# Altium schematic sheet Power.SchDoc
size A
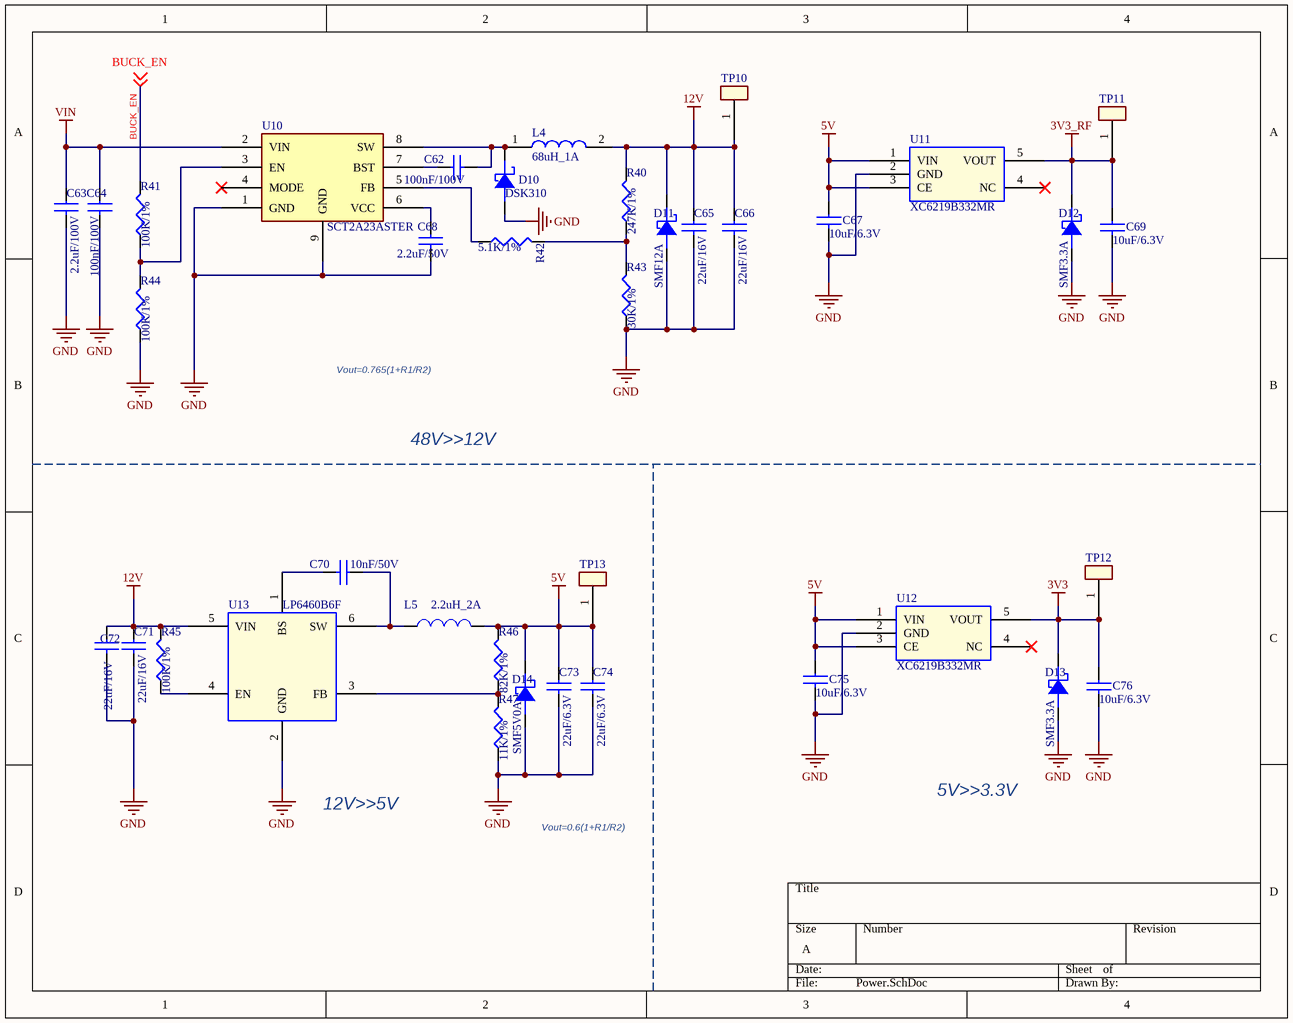
[diagram p0: Power.SchDoc]

## Parts
C62  100nF/100V  [C0603]
C63  2.2uF/100V  [C1206]
C64  100nF/100V  [C0603]
C65  22uF/16V  [C0805]
C66  22uF/16V  [C0805]
C67  10uF/6.3V  [C0402]
C68  2.2uF/50V  [C0603]
C69  10uF/6.3V  [C0402]
C70  10nF/50V  [C0402]
C71  22uF/16V  [C0805]
C72  22uF/16V  [C0805]
C73  22uF/6.3V  [C0805]
C74  22uF/6.3V  [C0805]
C75  10uF/6.3V  [C0402]
C76  10uF/6.3V  [C0402]
D10  DSK310  [SOD-123F]
D11  SMF12A  [SOD-123F]
D12  SMF3.3A  [SOD-123F]
D13  SMF3.3A  [SOD-123F]
D14  SMF5V0A  [SOD-123F]
L4  68uH_1A  [L5040]
L5  2.2uH_2A  [L4020]
R40  247K/1%  [R0402]
R41  100K/1%  [R0402]
R42  5.1K/1%  [R0402]
R43  30K/1%  [R0402]
R44  100K/1%  [R0402]
R45  100K/1%  [R0402]
R46  82K/1%  [R0402]
R47  11K/1%  [R0402]
TP10  TEST POINT  [test_point_100_smd]  (value not drawn)
TP11  TEST POINT  [test_point_100_smd]  (value not drawn)
TP12  TEST POINT  [test_point_100_smd]  (value not drawn)
TP13  TEST POINT  [test_point_100_smd]  (value not drawn)
U10  SCT2A23ASTER  [ESOP-8_L4.9-W3.9-P1.27-LS6.0-BL-EP]
U11  XC6219B332MR  [SOT-23-5]
U12  XC6219B332MR  [SOT-23-5]
U13  LP6460B6F  [SOT-23-6]

## Nets
3V3: C76.1 D13.1(K) TP12.1 U12.5(VOUT)
3V3_RF: C69.1 D12.1(K) TP11.1 U11.5(VOUT)
5V: C67.1 C73.1 C74.1 C75.1 D14.1(K) L5.2 R46.2 TP13.1 U11.1(VIN) U11.3(CE) U12.1(VIN) U12.3(CE)
12V: C65.1 C66.1 C71.1 C72.1 D11.1(K) L4.2 R40.2 R45.2 TP10.1 U13.5(VIN)
GND: C63.2 C64.2 C65.2 C66.2 C67.2 C68.2 C69.2 C71.2 C72.2 C73.2 C74.2 C75.2 C76.2 D10.2(A) D11.2(A) D12.2(A) D13.2(A) D14.2(A) R43.1 R44.1 R47.1 U10.1(GND) U10.9(GND) U11.2(GND) U12.2(GND) U13.2(GND)
VIN: C63.1 C64.1 U10.2(VIN)
BUCK_EN: R41.2 ; off-sheet BUCK_EN
NetC62_1: C62.1 U10.7(BST)
NetC62_2: C62.2 D10.1(K) L4.1 U10.8(SW)
NetC68_1: C68.1 U10.6(VCC)
NetC70_1: C70.1 L5.1 U13.6(SW)
NetC70_2: C70.2 U13.1(BS)
NetR40_1: R40.1 R42.2 R43.2
NetR41_1: R41.1 R44.2 U10.3(EN)
NetR42_1: R42.1 U10.5(FB)
NetR45_1: R45.1 U13.4(EN)
NetR46_1: R46.1 R47.2 U13.3(FB)

Not connected (* = marked no-connect by the designer): U10 4(MODE)*; U11 4(NC)*; U12 4(NC)*

## Notes on the sheet
- Vout=0.765(1+R1/R2)
- 48V>>12V
- 12V>>5V
- Vout=0.6(1+R1/R2)
- 5V>>3.3V

## Library data of the parts
C62-C76 = CAP NP
  C62 C64 C68: PCB Footprint: C0603
  C63: PCB Footprint: C1206
  C65 C66 C71-C74: PCB Footprint: C0805
  C67 C69 C70 C75 C76: PCB Footprint: C0402
D10-D14 = DIODE SCHOTTKY21: PCB Footprint: SOD-123F
L4 = 74404054221: Inductor; Manufacturer_Name: Wurth Elektronik; Datasheet Link: https://www.mouser.com/datasheet/2/445/74404054221-1280555.pdf; Height: 4mm; Manufacturer_Part_Number: 74404054221; Mouser Part Number: 710-74404054221; Mouser Price/Stock: https://www.mouser.co.uk/ProductDetail/Wurth-Elektronik/74404054221?qs=f9yNj16SXrLBSuRgk86STQ%3D%3D
L5 = INDUCTOR: PCB Footprint: L4020
R40-R47 = RESISTOR: PCB Footprint: R0402
U10 = SCT2A23ASTER: Manufacturer: SCT(芯洲科技); Add into BOM: yes; Function: 降压型; Input Voltage: 4.5V~100V; Output Current: 1.2A; Switching Frequency: 300kHz; Number of Outputs: 1; Switch tube (built-in/external): 内置; Symbol: SCT2A23ASTER; Device: SCT2A23ASTER; LCSC Part Name: 宽输入范围1.2A降压DC-DC转换器; Supplier Part: C2901894; Manufacturer Part: SCT2A23ASTER; Supplier Footprint: ESOP-8; Datasheet: https://atta.szlcsc.com/upload/public/pdf/source/20211013/6F4F933FB08DD1E1458E8CCC6D5C6936.pdf; Supplier: LCSC; Convert to PCB: yes; Operating Temperature: -40℃~+125℃@(TJ)
U11 U12 = XC6219B332MR: PCB Footprint: SOT-23-5
U13 = LP6460B6F: PCB Footprint: SOT-23-6